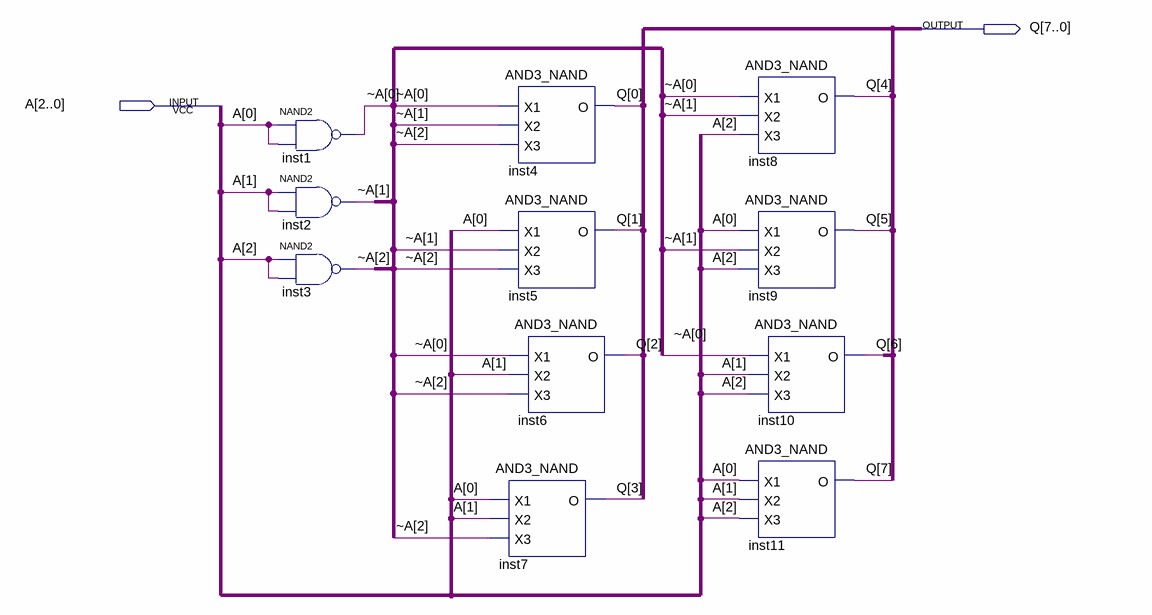
[diagram p0: schematic sheet]
// Quartus schematic DC_3_8_NAND.bdf as structural Verilog: 11 symbols, 2 pins
module DC_3_8_NAND (
  input  [2:0] A,
  output [7:0] Q
);

  wire [2:0] \~A ;

  nand inst1 (\~A [0], A[0], A[0]);
  nand inst2 (\~A [1], A[1], A[1]);
  nand inst3 (\~A [2], A[2], A[2]);
  AND3_NAND inst4 (.X1(\~A [0]), .X2(\~A [1]), .X3(\~A [2]), .O(Q[0]));
  AND3_NAND inst5 (.X1(A[0]), .X2(\~A [1]), .X3(\~A [2]), .O(Q[1]));
  AND3_NAND inst6 (.X1(\~A [0]), .X2(A[1]), .X3(\~A [2]), .O(Q[2]));
  AND3_NAND inst7 (.X1(A[0]), .X2(A[1]), .X3(\~A [2]), .O(Q[3]));
  AND3_NAND inst8 (.X1(\~A [0]), .X2(\~A [1]), .X3(A[2]), .O(Q[4]));
  AND3_NAND inst9 (.X1(A[0]), .X2(\~A [1]), .X3(A[2]), .O(Q[5]));
  AND3_NAND inst10 (.X1(\~A [0]), .X2(A[1]), .X3(A[2]), .O(Q[6]));
  AND3_NAND inst11 (.X1(A[0]), .X2(A[1]), .X3(A[2]), .O(Q[7]));
endmodule
